# EAGLE schematic botball_v5 (EAGLE 6.5.0), part 3 of 3
## Sheet 42 of 44
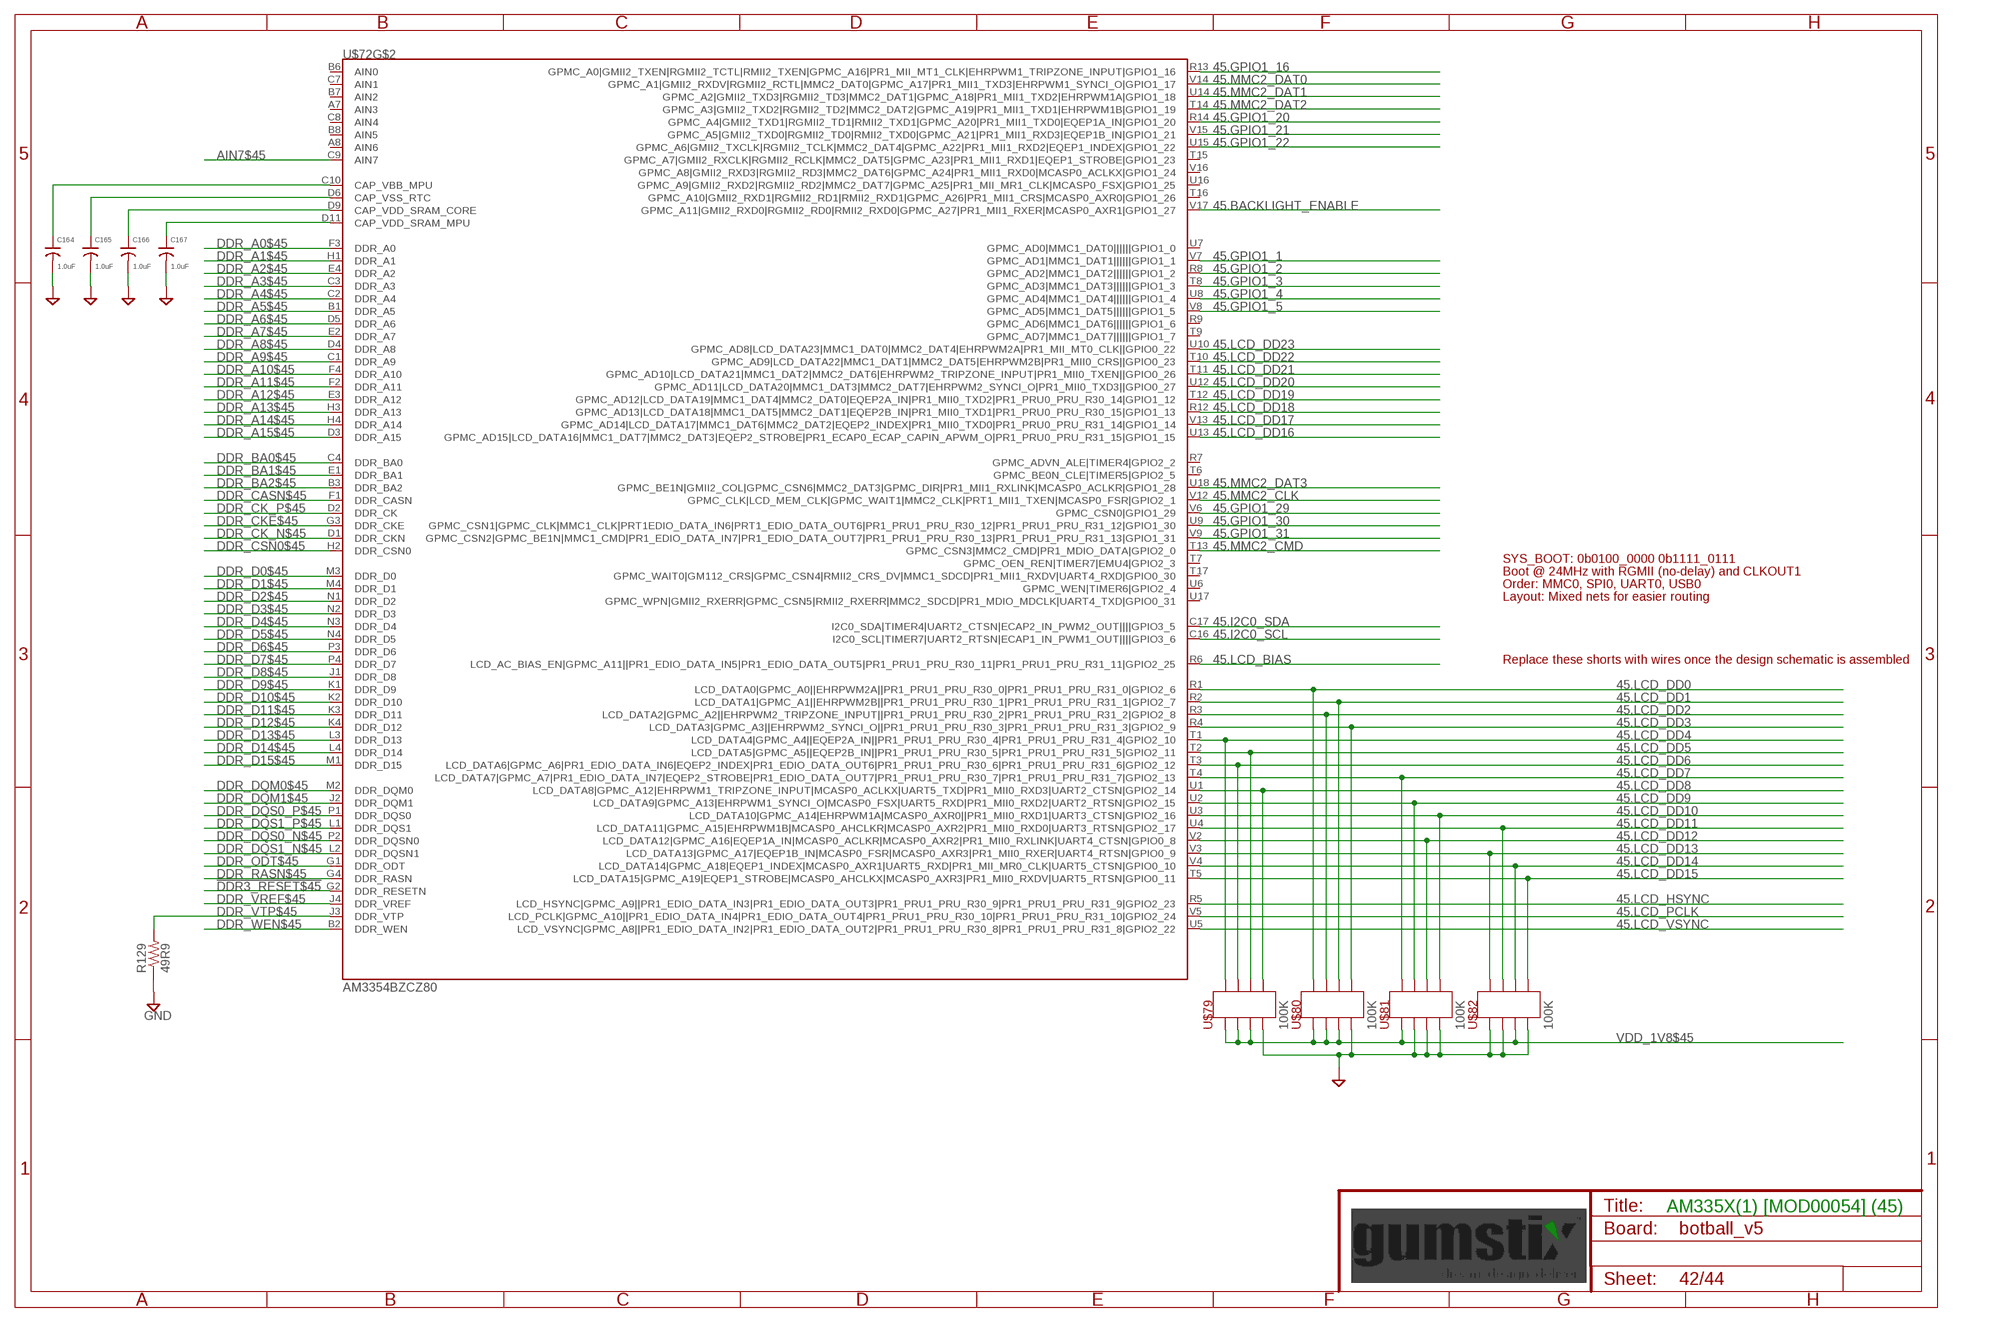
[diagram p41: schematic, sheet 42]

### Parts
C164  1.0uF  C0201  [0201]
C165  1.0uF  C0201  [0201]
C166  1.0uF  C0201  [0201]
C167  1.0uF  C0201  [0201]
R129  49R9  R0201  [0201]
U$72  AM3354BZCZ80  AM335_ZCZ  [BGA324C80P18X18]
U$79  100K  741C083  [741C083]
U$80  100K  741C083  [741C083]
U$81  100K  741C083  [741C083]
U$82  100K  741C083  [741C083]

### Nets
45.BACKLIGHT_ENABLE: U$72.V17(GPMC_A11|GMII2_RXD0|RGMII2_RD0|RMII2_RXD0|GPMC_A27|PR1_MII1_RXER|MCASP0_AXR1|GPIO1_27) ; also sheet 38
45.GPIO1_1: U$72.V7(GPMC_AD1|MMC1_DAT1||||||GPIO1_1) ; also sheet 37
45.GPIO1_2: U$72.R8(GPMC_AD2|MMC1_DAT2||||||GPIO1_2) ; also sheet 37
45.GPIO1_3: U$72.T8(GPMC_AD3|MMC1_DAT3||||||GPIO1_3) ; also sheet 11
45.GPIO1_4: U$72.U8(GPMC_AD4|MMC1_DAT4||||||GPIO1_4) ; also sheet 11
45.GPIO1_5: U$72.V8(GPMC_AD5|MMC1_DAT5||||||GPIO1_5) ; also sheet 39
45.GPIO1_16: U$72.R13(GPMC_A0|GMII2_TXEN|RGMII2_TCTL|RMII2_TXEN|GPMC_A16|PR1_MII_MT1_CLK|EHRPWM1_TRIPZONE_INPUT|GPIO1_16) ; also sheet 16
45.GPIO1_20: U$72.R14(GPMC_A4|GMII2_TXD1|RGMII2_TD1|RMII2_TXD1|GPMC_A20|PR1_MII1_TXD0|EQEP1A_IN|GPIO1_20) ; also sheet 24
45.GPIO1_21: U$72.V15(GPMC_A5|GMII2_TXD0|RGMII2_TD0|RMII2_TXD0|GPMC_A21|PR1_MII1_RXD3|EQEP1B_IN|GPIO1_21) ; also sheet 12
45.GPIO1_22: U$72.U15(GPMC_A6|GMII2_TXCLK|RGMII2_TCLK|MMC2_DAT4|GPMC_A22|PR1_MII1_RXD2|EQEP1_INDEX|GPIO1_22) ; also sheet 29
45.GPIO1_29: U$72.V6(GPMC_CSN0|GPIO1_29) ; also sheet 33
45.GPIO1_30: U$72.U9(GPMC_CSN1|GPMC_CLK|MMC1_CLK|PRT1EDIO_DATA_IN6|PRT1_EDIO_DATA_OUT6|PR1_PRU1_PRU_R30_12|PR1_PRU1_PRU_R31_12|GPIO1_30) ; also sheet 33
45.GPIO1_31: U$72.V9(GPMC_CSN2|GPMC_BE1N|MMC1_CMD|PR1_EDIO_DATA_IN7|PR1_EDIO_DATA_OUT7|PR1_PRU1_PRU_R30_13|PR1_PRU1_PRU_R31_13|GPIO1_31) ; also sheet 33
45.I2C0_SCL: U$72.C16(I2C0_SCL|TIMER7|UART2_RTSN|ECAP1_IN_PWM1_OUT||||GPIO3_6) ; also sheet 16,40,41
45.I2C0_SDA: U$72.C17(I2C0_SDA|TIMER4|UART2_CTSN|ECAP2_IN_PWM2_OUT||||GPIO3_5) ; also sheet 16,40,41
45.LCD_BIAS: U$72.R6(LCD_AC_BIAS_EN|GPMC_A11||PR1_EDIO_DATA_IN5|PR1_EDIO_DATA_OUT5|PR1_PRU1_PRU_R30_11|PR1_PRU1_PRU_R31_11|GPIO2_25) ; also sheet 38,39
45.LCD_DD0: U$72.R1(LCD_DATA0|GPMC_A0||EHRPWM2A||PR1_PRU1_PRU_R30_0|PR1_PRU1_PRU_R31_0|GPIO2_6) U$80.P5 ; also sheet 38,39
45.LCD_DD1: U$72.R2(LCD_DATA1|GPMC_A1||EHRPWM2B||PR1_PRU1_PRU_R30_1|PR1_PRU1_PRU_R31_1|GPIO2_7) U$80.P7 ; also sheet 38,39
45.LCD_DD2: U$72.R3(LCD_DATA2|GPMC_A2||EHRPWM2_TRIPZONE_INPUT||PR1_PRU1_PRU_R30_2|PR1_PRU1_PRU_R31_2|GPIO2_8) U$80.P6 ; also sheet 38,39
45.LCD_DD3: U$72.R4(LCD_DATA3|GPMC_A3||EHRPWM2_SYNCI_O||PR1_PRU1_PRU_R30_3|PR1_PRU1_PRU_R31_3|GPIO2_9) U$80.P8 ; also sheet 38,39
45.LCD_DD4: U$72.T1(LCD_DATA4|GPMC_A4||EQEP2A_IN||PR1_PRU1_PRU_R30_4|PR1_PRU1_PRU_R31_4|GPIO2_10) U$79.P5 ; also sheet 38,39
45.LCD_DD5: U$72.T2(LCD_DATA5|GPMC_A5||EQEP2B_IN||PR1_PRU1_PRU_R30_5|PR1_PRU1_PRU_R31_5|GPIO2_11) U$79.P7 ; also sheet 38,39
45.LCD_DD6: U$72.T3(LCD_DATA6|GPMC_A6|PR1_EDIO_DATA_IN6|EQEP2_INDEX|PR1_EDIO_DATA_OUT6|PR1_PRU1_PRU_R30_6|PR1_PRU1_PRU_R31_6|GPIO2_12) U$79.P6 ; also sheet 38,39
45.LCD_DD7: U$72.T4(LCD_DATA7|GPMC_A7|PR1_EDIO_DATA_IN7|EQEP2_STROBE|PR1_EDIO_DATA_OUT7|PR1_PRU1_PRU_R30_7|PR1_PRU1_PRU_R31_7|GPIO2_13) U$81.P5 ; also sheet 38,39
45.LCD_DD8: U$72.U1(LCD_DATA8|GPMC_A12|EHRPWM1_TRIPZONE_INPUT|MCASP0_ACLKX|UART5_TXD|PR1_MII0_RXD3|UART2_CTSN|GPIO2_14) U$79.P8 ; also sheet 38,39
45.LCD_DD9: U$72.U2(LCD_DATA9|GPMC_A13|EHRPWM1_SYNCI_O|MCASP0_FSX|UART5_RXD|PR1_MII0_RXD2|UART2_RTSN|GPIO2_15) U$81.P6 ; also sheet 38,39
45.LCD_DD10: U$72.U3(LCD_DATA10|GPMC_A14|EHRPWM1A|MCASP0_AXR0||PR1_MII0_RXD1|UART3_CTSN|GPIO2_16) U$81.P8 ; also sheet 38,39
45.LCD_DD11: U$72.U4(LCD_DATA11|GPMC_A15|EHRPWM1B|MCASP0_AHCLKR|MCASP0_AXR2|PR1_MII0_RXD0|UART3_RTSN|GPIO2_17) U$82.P6 ; also sheet 38,39
45.LCD_DD12: U$72.V2(LCD_DATA12|GPMC_A16|EQEP1A_IN|MCASP0_ACLKR|MCASP0_AXR2|PR1_MII0_RXLINK|UART4_CTSN|GPIO0_8) U$81.P7 ; also sheet 38,39
45.LCD_DD13: U$72.V3(LCD_DATA13|GPMC_A17|EQEP1B_IN|MCASP0_FSR|MCASP0_AXR3|PR1_MII0_RXER|UART4_RTSN|GPIO0_9) U$82.P5 ; also sheet 38,39
45.LCD_DD14: U$72.V4(LCD_DATA14|GPMC_A18|EQEP1_INDEX|MCASP0_AXR1|UART5_RXD|PR1_MII_MR0_CLK|UART5_CTSN|GPIO0_10) U$82.P7 ; also sheet 38,39
45.LCD_DD15: U$72.T5(LCD_DATA15|GPMC_A19|EQEP1_STROBE|MCASP0_AHCLKX|MCASP0_AXR3|PR1_MII0_RXDV|UART5_RTSN|GPIO0_11) U$82.P8 ; also sheet 38,39
45.LCD_DD16: U$72.U13(GPMC_AD15|LCD_DATA16|MMC1_DAT7|MMC2_DAT3|EQEP2_STROBE|PR1_ECAP0_ECAP_CAPIN_APWM_O|PR1_PRU0_PRU_R31_15|GPIO1_15) ; also sheet 38,39
45.LCD_DD17: U$72.V13(GPMC_AD14|LCD_DATA17|MMC1_DAT6|MMC2_DAT2|EQEP2_INDEX|PR1_MII0_TXD0|PR1_PRU0_PRU_R31_14|GPIO1_14) ; also sheet 38,39
45.LCD_DD18: U$72.R12(GPMC_AD13|LCD_DATA18|MMC1_DAT5|MMC2_DAT1|EQEP2B_IN|PR1_MII0_TXD1|PR1_PRU0_PRU_R30_15|GPIO1_13) ; also sheet 38,39
45.LCD_DD19: U$72.T12(GPMC_AD12|LCD_DATA19|MMC1_DAT4|MMC2_DAT0|EQEP2A_IN|PR1_MII0_TXD2|PR1_PRU0_PRU_R30_14|GPIO1_12) ; also sheet 38,39
45.LCD_DD20: U$72.U12(GPMC_AD11|LCD_DATA20|MMC1_DAT3|MMC2_DAT7|EHRPWM2_SYNCI_O|PR1_MII0_TXD3||GPIO0_27) ; also sheet 38,39
45.LCD_DD21: U$72.T11(GPMC_AD10|LCD_DATA21|MMC1_DAT2|MMC2_DAT6|EHRPWM2_TRIPZONE_INPUT|PR1_MII0_TXEN||GPIO0_26) ; also sheet 38,39
45.LCD_DD22: U$72.T10(GPMC_AD9|LCD_DATA22|MMC1_DAT1|MMC2_DAT5|EHRPWM2B|PR1_MII0_CRS||GPIO0_23) ; also sheet 38,39
45.LCD_DD23: U$72.U10(GPMC_AD8|LCD_DATA23|MMC1_DAT0|MMC2_DAT4|EHRPWM2A|PR1_MII_MT0_CLK||GPIO0_22) ; also sheet 38,39
45.LCD_HSYNC: U$72.R5(LCD_HSYNC|GPMC_A9||PR1_EDIO_DATA_IN3|PR1_EDIO_DATA_OUT3|PR1_PRU1_PRU_R30_9|PR1_PRU1_PRU_R31_9|GPIO2_23) ; also sheet 38,39
45.LCD_PCLK: U$72.V5(LCD_PCLK|GPMC_A10||PR1_EDIO_DATA_IN4|PR1_EDIO_DATA_OUT4|PR1_PRU1_PRU_R30_10|PR1_PRU1_PRU_R31_10|GPIO2_24) ; also sheet 38,39
45.LCD_VSYNC: U$72.U5(LCD_VSYNC|GPMC_A8||PR1_EDIO_DATA_IN2|PR1_EDIO_DATA_OUT2|PR1_PRU1_PRU_R30_8|PR1_PRU1_PRU_R31_8|GPIO2_22) ; also sheet 38,39
45.MMC2_CLK: U$72.V12(GPMC_CLK|LCD_MEM_CLK|GPMC_WAIT1|MMC2_CLK|PRT1_MII1_TXEN|MCASP0_FSR|GPIO2_1) ; also sheet 33
45.MMC2_CMD: U$72.T13(GPMC_CSN3|MMC2_CMD|PR1_MDIO_DATA|GPIO2_0) ; also sheet 33
45.MMC2_DAT0: U$72.V14(GPMC_A1|GMII2_RXDV|RGMII2_RCTL|MMC2_DAT0|GPMC_A17|PR1_MII1_TXD3|EHRPWM1_SYNCI_O|GPIO1_17) ; also sheet 33
45.MMC2_DAT1: U$72.U14(GPMC_A2|GMII2_TXD3|RGMII2_TD3|MMC2_DAT1|GPMC_A18|PR1_MII1_TXD2|EHRPWM1A|GPIO1_18) ; also sheet 33
45.MMC2_DAT2: U$72.T14(GPMC_A3|GMII2_TXD2|RGMII2_TD2|MMC2_DAT2|GPMC_A19|PR1_MII1_TXD1|EHRPWM1B|GPIO1_19) ; also sheet 33
45.MMC2_DAT3: U$72.U18(GPMC_BE1N|GMII2_COL|GPMC_CSN6|MMC2_DAT3|GPMC_DIR|PR1_MII1_RXLINK|MCASP0_ACLKR|GPIO1_28) ; also sheet 33
!DDR3_RESET$45: U$72.G2(DDR_RESETN) ; also sheet 41
AIN7$45 [analog]: U$72.C9(AIN7) ; also sheet 40
CAP_VBB_MPU$45: C164.1 U$72.C10(CAP_VBB_MPU)
CAP_VDD_SRAM_CORE$45: C166.1 U$72.D9(CAP_VDD_SRAM_CORE)
CAP_VDD_SRAM_MPU$45: C167.1 U$72.D11(CAP_VDD_SRAM_MPU)
CAP_VSS_RTC$45: C165.1 U$72.D6(CAP_VSS_RTC)
DDR_A0$45: U$72.F3(DDR_A0) ; also sheet 41
DDR_A1$45: U$72.H1(DDR_A1) ; also sheet 41
DDR_A2$45: U$72.E4(DDR_A2) ; also sheet 41
DDR_A3$45: U$72.C3(DDR_A3) ; also sheet 41
DDR_A4$45: U$72.C2(DDR_A4) ; also sheet 41
DDR_A5$45: U$72.B1(DDR_A5) ; also sheet 41
DDR_A6$45: U$72.D5(DDR_A6) ; also sheet 41
DDR_A7$45: U$72.E2(DDR_A7) ; also sheet 41
DDR_A8$45: U$72.D4(DDR_A8) ; also sheet 41
DDR_A9$45: U$72.C1(DDR_A9) ; also sheet 41
DDR_A10$45: U$72.F4(DDR_A10) ; also sheet 41
DDR_A11$45: U$72.F2(DDR_A11) ; also sheet 41
DDR_A12$45: U$72.E3(DDR_A12) ; also sheet 41
DDR_A13$45: U$72.H3(DDR_A13) ; also sheet 41
DDR_A14$45: U$72.H4(DDR_A14) ; also sheet 41
DDR_A15$45: U$72.D3(DDR_A15) ; also sheet 41
DDR_BA0$45: U$72.C4(DDR_BA0) ; also sheet 41
DDR_BA1$45: U$72.E1(DDR_BA1) ; also sheet 41
DDR_BA2$45: U$72.B3(DDR_BA2) ; also sheet 41
DDR_CASN$45: U$72.F1(DDR_CASN) ; also sheet 41
DDR_CK_N$45: U$72.D1(DDR_CKN) ; also sheet 41
DDR_CK_P$45: U$72.D2(DDR_CK) ; also sheet 41
DDR_CKE$45: U$72.G3(DDR_CKE) ; also sheet 41
DDR_CSN0$45: U$72.H2(DDR_CSN0) ; also sheet 41
DDR_D0$45: U$72.M3(DDR_D0) ; also sheet 41
DDR_D1$45: U$72.M4(DDR_D1) ; also sheet 41
DDR_D2$45: U$72.N1(DDR_D2) ; also sheet 41
DDR_D3$45: U$72.N2(DDR_D3) ; also sheet 41
DDR_D4$45: U$72.N3(DDR_D4) ; also sheet 41
DDR_D5$45: U$72.N4(DDR_D5) ; also sheet 41
DDR_D6$45: U$72.P3(DDR_D6) ; also sheet 41
DDR_D7$45: U$72.P4(DDR_D7) ; also sheet 41
DDR_D8$45: U$72.J1(DDR_D8) ; also sheet 41
DDR_D9$45: U$72.K1(DDR_D9) ; also sheet 41
DDR_D10$45: U$72.K2(DDR_D10) ; also sheet 41
DDR_D11$45: U$72.K3(DDR_D11) ; also sheet 41
DDR_D12$45: U$72.K4(DDR_D12) ; also sheet 41
DDR_D13$45: U$72.L3(DDR_D13) ; also sheet 41
DDR_D14$45: U$72.L4(DDR_D14) ; also sheet 41
DDR_D15$45: U$72.M1(DDR_D15) ; also sheet 41
DDR_DQM0$45: U$72.M2(DDR_DQM0) ; also sheet 41
DDR_DQM1$45: U$72.J2(DDR_DQM1) ; also sheet 41
DDR_DQS0_N$45: U$72.P2(DDR_DQSN0) ; also sheet 41
DDR_DQS0_P$45: U$72.P1(DDR_DQS0) ; also sheet 41
DDR_DQS1_N$45: U$72.L2(DDR_DQSN1) ; also sheet 41
DDR_DQS1_P$45: U$72.L1(DDR_DQS1) ; also sheet 41
DDR_ODT$45: U$72.G1(DDR_ODT) ; also sheet 41
DDR_RASN$45: U$72.G4(DDR_RASN) ; also sheet 41
DDR_VREF$45: U$72.J4(DDR_VREF) ; also sheet 41
DDR_VTP$45: R129.2 U$72.J3(DDR_VTP)
DDR_WEN$45: U$72.B2(DDR_WEN) ; also sheet 41
GND: C164.2 C165.2 C166.2 C167.2 R129.1 U$79.P4 U$80.P4 U$81.P2 U$81.P3 U$81.P4 U$82.P1 U$82.P2 U$82.P4 ; also sheet 2,3,4,5,6,7,9,10,11,12,13,14,15,16,17,18,19,20,21,22,23,24,25,26,27,28,29,30,31,32,33,34,35,36,37,38,39,40,41,43,44
VDD_1V8$45 [supply]: U$79.P1 U$79.P2 U$79.P3 U$80.P1 U$80.P2 U$80.P3 U$81.P1 U$82.P3 ; also sheet 40,41,43,44
Unconnected: U$72.A7(AIN3) U$72.A8(AIN6) U$72.B6(AIN0) U$72.B7(AIN2) U$72.B8(AIN5) U$72.C7(AIN1) U$72.C8(AIN4) U$72.R7(GPMC_ADVN_ALE|TIMER4|GPIO2_2) U$72.R9(GPMC_AD6|MMC1_DAT6||||||GPIO1_6) U$72.T6(GPMC_BE0N_CLE|TIMER5|GPIO2_5) U$72.T7(GPMC_OEN_REN|TIMER7|EMU4|GPIO2_3) U$72.T9(GPMC_AD7|MMC1_DAT7||||||GPIO1_7) U$72.T15(GPMC_A7|GMII2_RXCLK|RGMII2_RCLK|MMC2_DAT5|GPMC_A23|PR1_MII1_RXD1|EQEP1_STROBE|GPIO1_23) U$72.T16(GPMC_A10|GMII2_RXD1|RGMII2_RD1|RMII2_RXD1|GPMC_A26|PR1_MII1_CRS|MCASP0_AXR0|GPIO1_26) U$72.T17(GPMC_WAIT0|GM112_CRS|GPMC_CSN4|RMII2_CRS_DV|MMC1_SDCD|PR1_MII1_RXDV|UART4_RXD|GPIO0_30) U$72.U6(GPMC_WEN|TIMER6|GPIO2_4) U$72.U7(GPMC_AD0|MMC1_DAT0||||||GPIO1_0) U$72.U16(GPMC_A9|GMII2_RXD2|RGMII2_RD2|MMC2_DAT7|GPMC_A25|PR1_MII_MR1_CLK|MCASP0_FSX|GPIO1_25) U$72.U17(GPMC_WPN|GMII2_RXERR|GPMC_CSN5|RMII2_RXERR|MMC2_SDCD|PR1_MDIO_MDCLK|UART4_TXD|GPIO0_31) U$72.V16(GPMC_A8|GMII2_RXD3|RGMII2_RD3|MMC2_DAT6|GPMC_A24|PR1_MII1_RXD0|MCASP0_ACLKX|GPIO1_24)

### Notes on the sheet
- SYS_BOOT: 0b0100_0000 0b1111_0111
- Boot @ 24MHz with RGMII (no-delay) and CLKOUT1
- Order: MMC0, SPI0, UART0, USB0
- Layout: Mixed nets for easier routing
- Replace these shorts with wires once the design schematic is assembled
- AM335X(1) [MOD00054] (45)

## Sheet 43 of 44
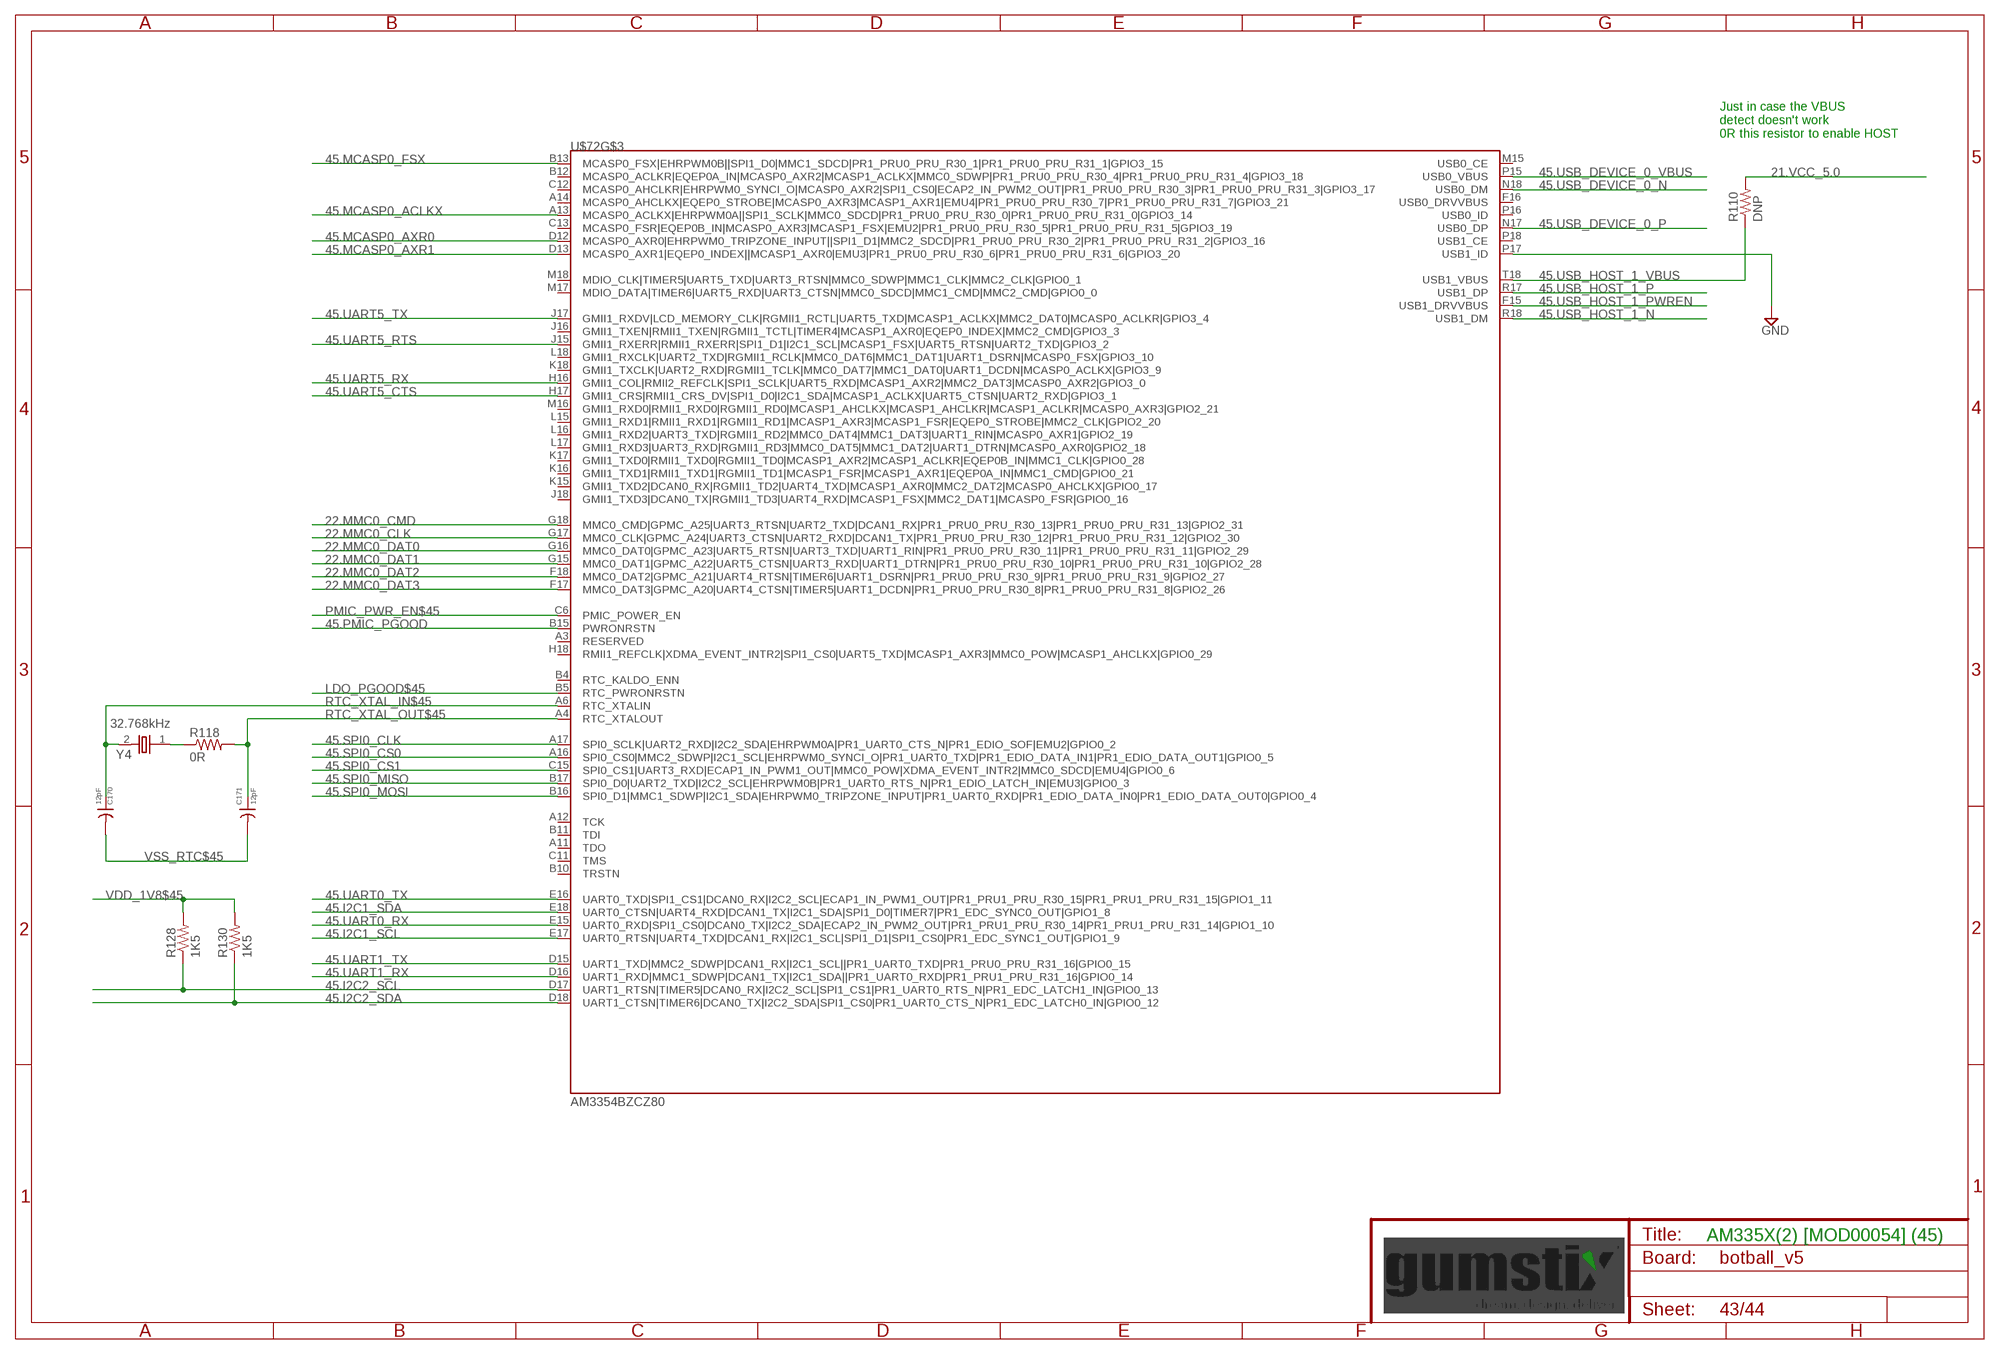
[diagram p42: schematic, sheet 43]

### Parts
C170  12pF  C0201  [0201]
C171  12pF  C0201  [0201]
R110  DNP  R0603  [0603]
R118  0R  R0201  [0201]
R128  1K5  R0201  [0201]
R130  1K5  R0201  [0201]
Y4  32.768kHz  X21206  [1206]

### Nets
21.VCC_5.0 [supply]: R110.2 ; also sheet 2,3,7,8,10,13,15,21,22,25,27,28,31,32,34,39,40
22.MMC0_CLK: U$72.G17(MMC0_CLK|GPMC_A24|UART3_CTSN|UART2_RXD|DCAN1_TX|PR1_PRU0_PRU_R30_12|PR1_PRU0_PRU_R31_12|GPIO2_30) ; also sheet 23
22.MMC0_CMD: U$72.G18(MMC0_CMD|GPMC_A25|UART3_RTSN|UART2_TXD|DCAN1_RX|PR1_PRU0_PRU_R30_13|PR1_PRU0_PRU_R31_13|GPIO2_31) ; also sheet 23
22.MMC0_DAT0: U$72.G16(MMC0_DAT0|GPMC_A23|UART5_RTSN|UART3_TXD|UART1_RIN|PR1_PRU0_PRU_R30_11|PR1_PRU0_PRU_R31_11|GPIO2_29) ; also sheet 23
22.MMC0_DAT1: U$72.G15(MMC0_DAT1|GPMC_A22|UART5_CTSN|UART3_RXD|UART1_DTRN|PR1_PRU0_PRU_R30_10|PR1_PRU0_PRU_R31_10|GPIO2_28) ; also sheet 23
22.MMC0_DAT2: U$72.F18(MMC0_DAT2|GPMC_A21|UART4_RTSN|TIMER6|UART1_DSRN|PR1_PRU0_PRU_R30_9|PR1_PRU0_PRU_R31_9|GPIO2_27) ; also sheet 23
22.MMC0_DAT3: U$72.F17(MMC0_DAT3|GPMC_A20|UART4_CTSN|TIMER5|UART1_DCDN|PR1_PRU0_PRU_R30_8|PR1_PRU0_PRU_R31_8|GPIO2_26) ; also sheet 23
45.I2C1_SCL: U$72.E17(UART0_RTSN|UART4_TXD|DCAN1_RX|I2C1_SCL|SPI1_D1|SPI1_CS0|PR1_EDC_SYNC1_OUT|GPIO1_9) ; also sheet 6,39
45.I2C1_SDA: U$72.E18(UART0_CTSN|UART4_RXD|DCAN1_TX|I2C1_SDA|SPI1_D0|TIMER7|PR1_EDC_SYNC0_OUT|GPIO1_8) ; also sheet 6,39
45.I2C2_SCL: R128.1 U$72.D17(UART1_RTSN|TIMER5|DCAN0_RX|I2C2_SCL|SPI1_CS1|PR1_UART0_RTS_N|PR1_EDC_LATCH1_IN|GPIO0_13) ; also sheet 2
45.I2C2_SDA: R130.1 U$72.D18(UART1_CTSN|TIMER6|DCAN0_TX|I2C2_SDA|SPI1_CS0|PR1_UART0_CTS_N|PR1_EDC_LATCH0_IN|GPIO0_12) ; also sheet 2
45.MCASP0_ACLKX: U$72.A13(MCASP0_ACLKX|EHRPWM0A||SPI1_SCLK|MMC0_SDCD|PR1_PRU0_PRU_R30_0|PR1_PRU0_PRU_R31_0|GPIO3_14) ; also sheet 16
45.MCASP0_AXR0: U$72.D12(MCASP0_AXR0|EHRPWM0_TRIPZONE_INPUT||SPI1_D1|MMC2_SDCD|PR1_PRU0_PRU_R30_2|PR1_PRU0_PRU_R31_2|GPIO3_16) ; also sheet 16
45.MCASP0_AXR1: U$72.D13(MCASP0_AXR1|EQEP0_INDEX||MCASP1_AXR0|EMU3|PR1_PRU0_PRU_R30_6|PR1_PRU0_PRU_R31_6|GPIO3_20) ; also sheet 16
45.MCASP0_FSX: U$72.B13(MCASP0_FSX|EHRPWM0B||SPI1_D0|MMC1_SDCD|PR1_PRU0_PRU_R30_1|PR1_PRU0_PRU_R31_1|GPIO3_15) ; also sheet 16
45.PMIC_PGOOD: U$72.B15(PWRONRSTN) ; also sheet 18,40
45.SPI0_CLK: U$72.A17(SPI0_SCLK|UART2_RXD|I2C2_SDA|EHRPWM0A|PR1_UART0_CTS_N|PR1_EDIO_SOF|EMU2|GPIO0_2) ; also sheet 9,38
45.SPI0_CS0: U$72.A16(SPI0_CS0|MMC2_SDWP|I2C1_SCL|EHRPWM0_SYNCI_O|PR1_UART0_TXD|PR1_EDIO_DATA_IN1|PR1_EDIO_DATA_OUT1|GPIO0_5) ; also sheet 38
45.SPI0_CS1: U$72.C15(SPI0_CS1|UART3_RXD|ECAP1_IN_PWM1_OUT|MMC0_POW|XDMA_EVENT_INTR2|MMC0_SDCD|EMU4|GPIO0_6) ; also sheet 9
45.SPI0_MISO: U$72.B17(SPI0_D0|UART2_TXD|I2C2_SCL|EHRPWM0B|PR1_UART0_RTS_N|PR1_EDIO_LATCH_IN|EMU3|GPIO0_3) ; also sheet 9,38
45.SPI0_MOSI: U$72.B16(SPI0_D1|MMC1_SDWP|I2C1_SDA|EHRPWM0_TRIPZONE_INPUT|PR1_UART0_RXD|PR1_EDIO_DATA_IN0|PR1_EDIO_DATA_OUT0|GPIO0_4) ; also sheet 9,38
45.UART0_RX: U$72.E15(UART0_RXD|SPI1_CS0|DCAN0_TX|I2C2_SDA|ECAP2_IN_PWM2_OUT|PR1_PRU1_PRU_R30_14|PR1_PRU1_PRU_R31_14|GPIO1_10) ; also sheet 32
45.UART0_TX: U$72.E16(UART0_TXD|SPI1_CS1|DCAN0_RX|I2C2_SCL|ECAP1_IN_PWM1_OUT|PR1_PRU1_PRU_R30_15|PR1_PRU1_PRU_R31_15|GPIO1_11) ; also sheet 32
45.UART1_RX: U$72.D16(UART1_RXD|MMC1_SDWP|DCAN1_TX|I2C1_SDA||PR1_UART0_RXD|PR1_PRU1_PRU_R31_16|GPIO0_14) ; also sheet 17
45.UART1_TX: U$72.D15(UART1_TXD|MMC2_SDWP|DCAN1_RX|I2C1_SCL||PR1_UART0_TXD|PR1_PRU0_PRU_R31_16|GPIO0_15) ; also sheet 17
45.UART5_CTS: U$72.H17(GMII1_CRS|RMII1_CRS_DV|SPI1_D0|I2C1_SDA|MCASP1_ACLKX|UART5_CTSN|UART2_RXD|GPIO3_1) ; also sheet 33
45.UART5_RTS: U$72.J15(GMII1_RXERR|RMII1_RXERR|SPI1_D1|I2C1_SCL|MCASP1_FSX|UART5_RTSN|UART2_TXD|GPIO3_2) ; also sheet 33
45.UART5_RX: U$72.H16(GMII1_COL|RMII2_REFCLK|SPI1_SCLK|UART5_RXD|MCASP1_AXR2|MMC2_DAT3|MCASP0_AXR2|GPIO3_0) ; also sheet 33
45.UART5_TX: U$72.J17(GMII1_RXDV|LCD_MEMORY_CLK|RGMII1_RCTL|UART5_TXD|MCASP1_ACLKX|MMC2_DAT0|MCASP0_ACLKR|GPIO3_4) ; also sheet 33
45.USB_DEVICE_0_N [USB]: U$72.N18(USB0_DM) ; also sheet 35
45.USB_DEVICE_0_P [USB]: U$72.N17(USB0_DP) ; also sheet 35
45.USB_DEVICE_0_VBUS: U$72.P15(USB0_VBUS) ; also sheet 35
45.USB_HOST_1_N [USB]: U$72.R18(USB1_DM) ; also sheet 21
45.USB_HOST_1_P [USB]: U$72.R17(USB1_DP) ; also sheet 21
45.USB_HOST_1_PWREN: U$72.F15(USB1_DRVVBUS) ; also sheet 21
45.USB_HOST_1_VBUS [supply]: R110.1 U$72.T18(USB1_VBUS) ; also sheet 21
GND: U$72.P17(USB1_ID) ; also sheet 2,3,4,5,6,7,9,10,11,12,13,14,15,16,17,18,19,20,21,22,23,24,25,26,27,28,29,30,31,32,33,34,35,36,37,38,39,40,41,42,44
LDO_PGOOD$45: U$72.B5(RTC_PWRONRSTN) ; also sheet 40
PMIC_PWR_EN$45: U$72.C6(PMIC_POWER_EN) ; also sheet 40
RTC_XTAL_IN$45: C170.1 U$72.A6(RTC_XTALIN) Y4.2
RTC_XTAL_OUT$45: C171.1 R118.2 U$72.A4(RTC_XTALOUT)
RTC_XTAL_PRE_OUT$45: R118.1 Y4.1
VDD_1V8$45 [supply]: R128.2 R130.2 ; also sheet 40,41,42,44
VSS_RTC$45: C170.2 C171.2 ; also sheet 44
Unconnected: U$72.A3(RESERVED) U$72.A11(TDO) U$72.A12(TCK) U$72.A14(MCASP0_AHCLKX|EQEP0_STROBE|MCASP0_AXR3|MCASP1_AXR1|EMU4|PR1_PRU0_PRU_R30_7|PR1_PRU0_PRU_R31_7|GPIO3_21) U$72.B4(RTC_KALDO_ENN) U$72.B10(TRSTN) U$72.B11(TDI) U$72.B12(MCASP0_ACLKR|EQEP0A_IN|MCASP0_AXR2|MCASP1_ACLKX|MMC0_SDWP|PR1_PRU0_PRU_R30_4|PR1_PRU0_PRU_R31_4|GPIO3_18) U$72.C11(TMS) U$72.C12(MCASP0_AHCLKR|EHRPWM0_SYNCI_O|MCASP0_AXR2|SPI1_CS0|ECAP2_IN_PWM2_OUT|PR1_PRU0_PRU_R30_3|PR1_PRU0_PRU_R31_3|GPIO3_17) U$72.C13(MCASP0_FSR|EQEP0B_IN|MCASP0_AXR3|MCASP1_FSX|EMU2|PR1_PRU0_PRU_R30_5|PR1_PRU0_PRU_R31_5|GPIO3_19) U$72.F16(USB0_DRVVBUS) U$72.H18(RMII1_REFCLK|XDMA_EVENT_INTR2|SPI1_CS0|UART5_TXD|MCASP1_AXR3|MMC0_POW|MCASP1_AHCLKX|GPIO0_29) U$72.J16(GMII1_TXEN|RMII1_TXEN|RGMII1_TCTL|TIMER4|MCASP1_AXR0|EQEP0_INDEX|MMC2_CMD|GPIO3_3) U$72.J18(GMII1_TXD3|DCAN0_TX|RGMII1_TD3|UART4_RXD|MCASP1_FSX|MMC2_DAT1|MCASP0_FSR|GPIO0_16) U$72.K15(GMII1_TXD2|DCAN0_RX|RGMII1_TD2|UART4_TXD|MCASP1_AXR0|MMC2_DAT2|MCASP0_AHCLKX|GPIO0_17) U$72.K16(GMII1_TXD1|RMII1_TXD1|RGMII1_TD1|MCASP1_FSR|MCASP1_AXR1|EQEP0A_IN|MMC1_CMD|GPIO0_21) U$72.K17(GMII1_TXD0|RMII1_TXD0|RGMII1_TD0|MCASP1_AXR2|MCASP1_ACLKR|EQEP0B_IN|MMC1_CLK|GPIO0_28) U$72.K18(GMII1_TXCLK|UART2_RXD|RGMII1_TCLK|MMC0_DAT7|MMC1_DAT0|UART1_DCDN|MCASP0_ACLKX|GPIO3_9) U$72.L15(GMII1_RXD1|RMII1_RXD1|RGMII1_RD1|MCASP1_AXR3|MCASP1_FSR|EQEP0_STROBE|MMC2_CLK|GPIO2_20) U$72.L16(GMII1_RXD2|UART3_TXD|RGMII1_RD2|MMC0_DAT4|MMC1_DAT3|UART1_RIN|MCASP0_AXR1|GPIO2_19) U$72.L17(GMII1_RXD3|UART3_RXD|RGMII1_RD3|MMC0_DAT5|MMC1_DAT2|UART1_DTRN|MCASP0_AXR0|GPIO2_18) U$72.L18(GMII1_RXCLK|UART2_TXD|RGMII1_RCLK|MMC0_DAT6|MMC1_DAT1|UART1_DSRN|MCASP0_FSX|GPIO3_10) U$72.M15(USB0_CE) U$72.M16(GMII1_RXD0|RMII1_RXD0|RGMII1_RD0|MCASP1_AHCLKX|MCASP1_AHCLKR|MCASP1_ACLKR|MCASP0_AXR3|GPIO2_21) U$72.M17(MDIO_DATA|TIMER6|UART5_RXD|UART3_CTSN|MMC0_SDCD|MMC1_CMD|MMC2_CMD|GPIO0_0) U$72.M18(MDIO_CLK|TIMER5|UART5_TXD|UART3_RTSN|MMC0_SDWP|MMC1_CLK|MMC2_CLK|GPIO0_1) U$72.P16(USB0_ID) U$72.P18(USB1_CE)

### Notes on the sheet
- Just in case the VBUS
  detect doesn't work
  0R this resistor to enable HOST
- AM335X(2) [MOD00054] (45)

## Sheet 44 of 44
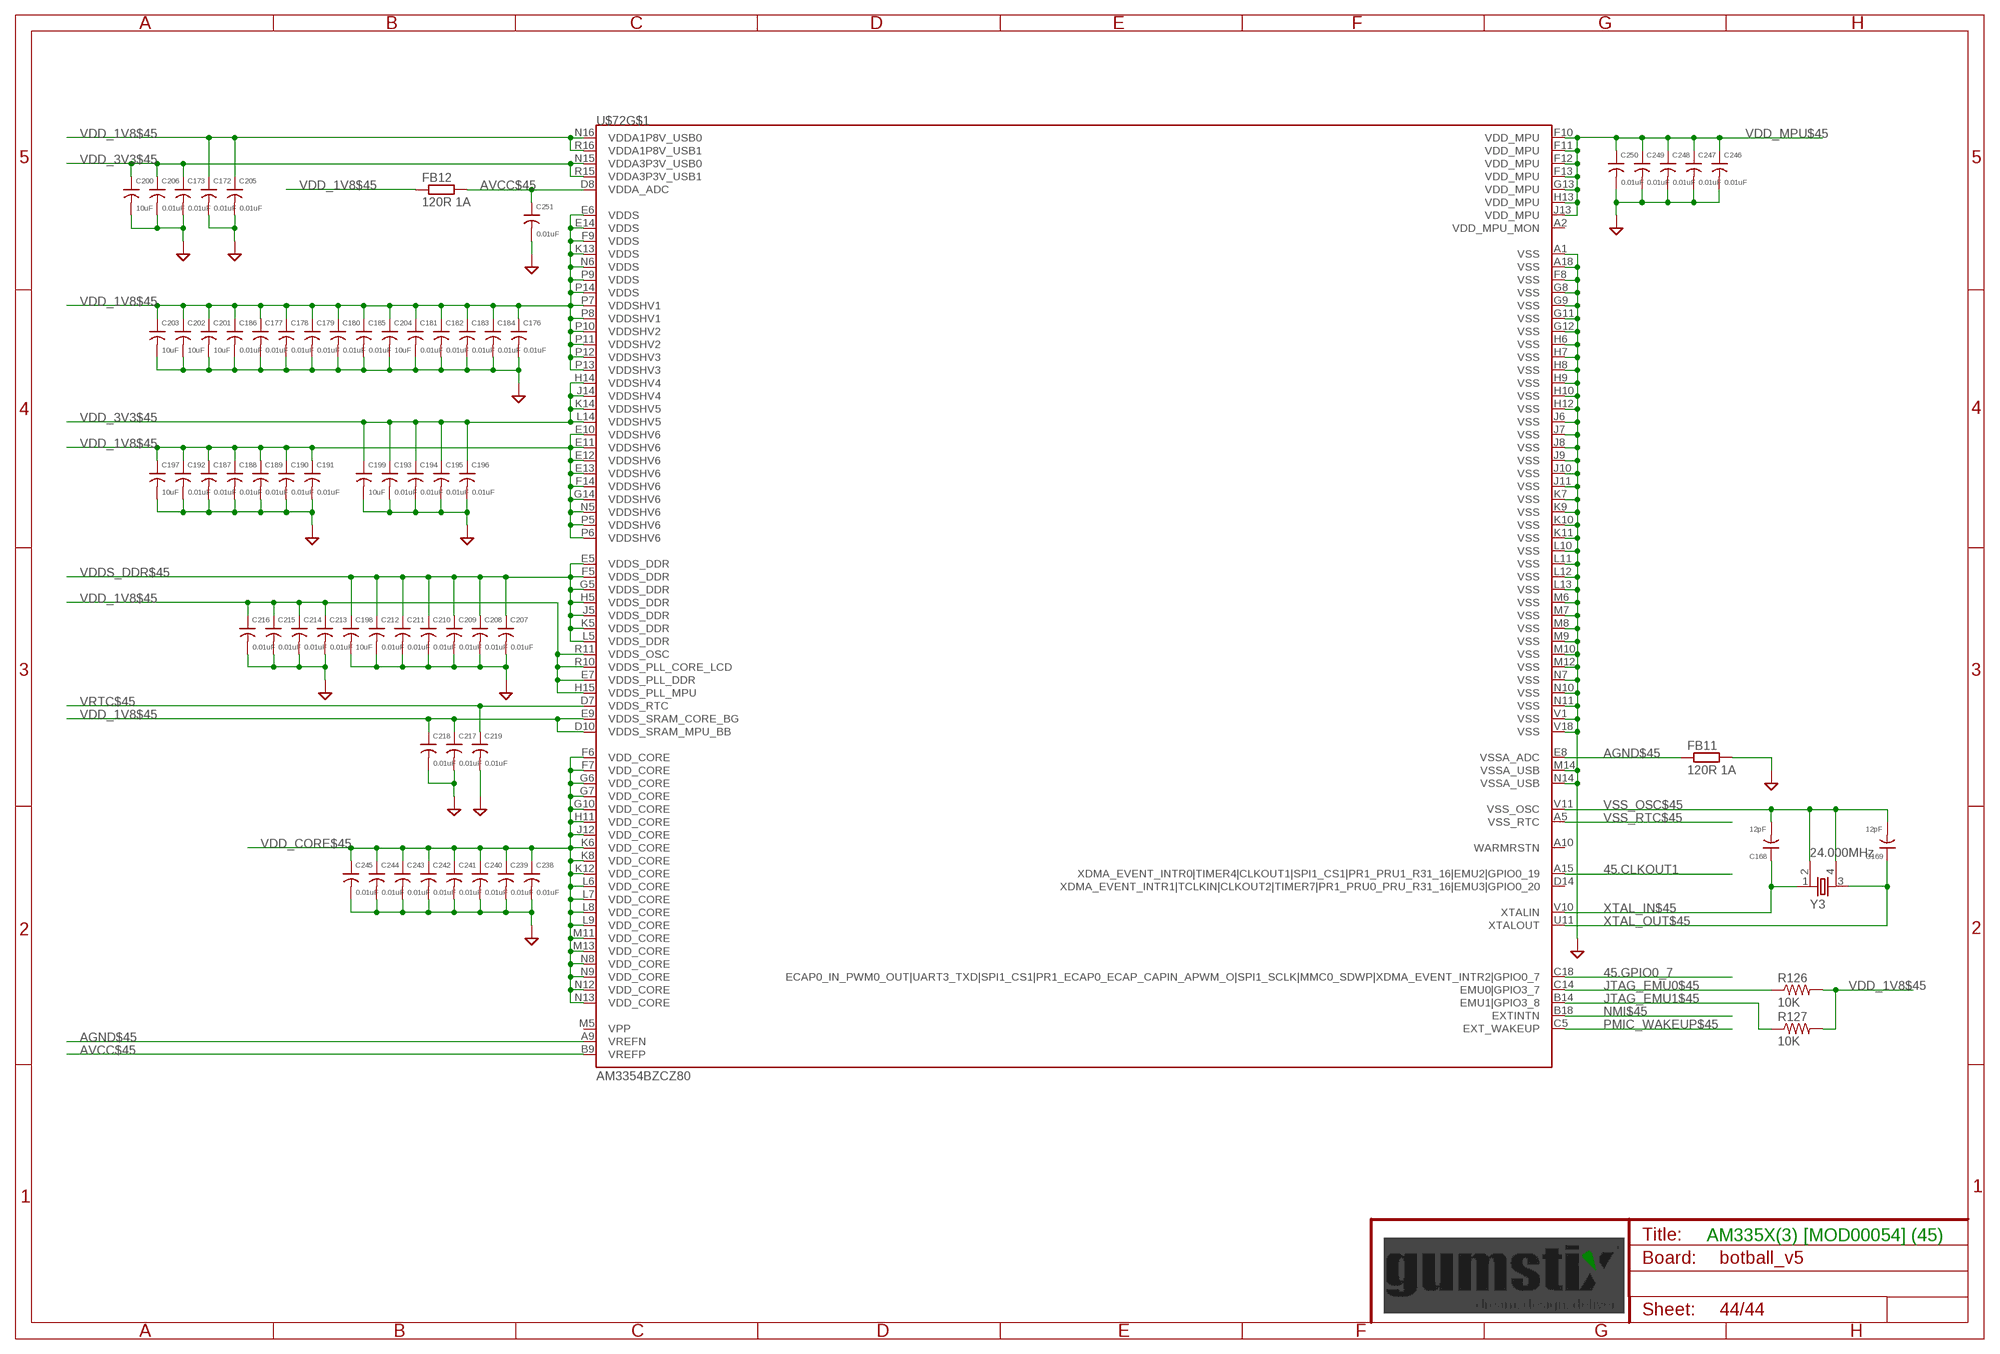
[diagram p43: schematic, sheet 44]

### Parts
C168  12pF  C0201  [0201]
C169  12pF  C0201  [0201]
C172  0.01uF  C0201  [0201]
C173  0.01uF  C0201  [0201]
C176  0.01uF  C0201  [0201]
C177  0.01uF  C0201  [0201]
C178  0.01uF  C0201  [0201]
C179  0.01uF  C0201  [0201]
C180  0.01uF  C0201  [0201]
C181  0.01uF  C0201  [0201]
C182  0.01uF  C0201  [0201]
C183  0.01uF  C0201  [0201]
C184  0.01uF  C0201  [0201]
C185  0.01uF  C0201  [0201]
C186  0.01uF  C0201  [0201]
C187  0.01uF  C0201  [0201]
C188  0.01uF  C0201  [0201]
C189  0.01uF  C0201  [0201]
C190  0.01uF  C0201  [0201]
C191  0.01uF  C0201  [0201]
C192  0.01uF  C0201  [0201]
C193  0.01uF  C0201  [0201]
C194  0.01uF  C0201  [0201]
C195  0.01uF  C0201  [0201]
C196  0.01uF  C0201  [0201]
C197  10uF  C0603  [0603]
C198  10uF  C0603  [0603]
C199  10uF  C0603  [0603]
C200  10uF  C0603  [0603]
C201  10uF  C0603  [0603]
C202  10uF  C0603  [0603]
C203  10uF  C0603  [0603]
C204  10uF  C0603  [0603]
C205  0.01uF  C0201  [0201]
C206  0.01uF  C0201  [0201]
C207  0.01uF  C0201  [0201]
C208  0.01uF  C0201  [0201]
C209  0.01uF  C0201  [0201]
C210  0.01uF  C0201  [0201]
C211  0.01uF  C0201  [0201]
C212  0.01uF  C0201  [0201]
C213  0.01uF  C0201  [0201]
C214  0.01uF  C0201  [0201]
C215  0.01uF  C0201  [0201]
C216  0.01uF  C0201  [0201]
C217  0.01uF  C0201  [0201]
C218  0.01uF  C0201  [0201]
C219  0.01uF  C0201  [0201]
C238  0.01uF  C0201  [0201]
C239  0.01uF  C0201  [0201]
C240  0.01uF  C0201  [0201]
C241  0.01uF  C0201  [0201]
C242  0.01uF  C0201  [0201]
C243  0.01uF  C0201  [0201]
C244  0.01uF  C0201  [0201]
C245  0.01uF  C0201  [0201]
C246  0.01uF  C0201  [0201]
C247  0.01uF  C0201  [0201]
C248  0.01uF  C0201  [0201]
C249  0.01uF  C0201  [0201]
C250  0.01uF  C0201  [0201]
C251  0.01uF  C0201  [0201]
FB11  120R 1A  FB0402  [0402]
FB12  120R 1A  FB0402  [0402]
R126  10K  R0201  [0201]
R127  10K  R0201  [0201]
Y3  24.000MHz  Y4CRYSTAL-3225  [CRYSTAL-3225]

### Nets
45.CLKOUT1: U$72.A15(XDMA_EVENT_INTR0|TIMER4|CLKOUT1|SPI1_CS1|PR1_PRU1_R31_16|EMU2|GPIO0_19) ; also sheet 33
45.GPIO0_7: U$72.C18(ECAP0_IN_PWM0_OUT|UART3_TXD|SPI1_CS1|PR1_ECAP0_ECAP_CAPIN_APWM_O|SPI1_SCLK|MMC0_SDWP|XDMA_EVENT_INTR2|GPIO0_7) ; also sheet 38
AGND$45: FB11.1 U$72.A9(VREFN) U$72.E8(VSSA_ADC)
AVCC$45 [analog]: C251.1 FB12.2 U$72.B9(VREFP) U$72.D8(VDDA_ADC)
GND: C172.2 C173.2 C176.2 C177.2 C178.2 C179.2 C180.2 C181.2 C182.2 C183.2 C184.2 C185.2 C186.2 C187.2 C188.2 C189.2 C190.2 C191.2 C192.2 C193.2 C194.2 C195.2 C196.2 C197.2 C198.2 C199.2 C200.2 C201.2 C202.2 C203.2 C204.2 C205.2 C206.2 C207.2 C208.2 C209.2 C210.2 C211.2 C212.2 C213.2 C214.2 C215.2 C216.2 C217.2 C218.2 C219.2 C238.2 C239.2 C240.2 C241.2 C242.2 C243.2 C244.2 C245.2 C246.2 C247.2 C248.2 C249.2 C250.2 C251.2 FB11.2 U$72.A1(VSS) U$72.A18(VSS) U$72.F8(VSS) U$72.G8(VSS) U$72.G9(VSS) U$72.G11(VSS) U$72.G12(VSS) U$72.H6(VSS) U$72.H7(VSS) U$72.H8(VSS) U$72.H9(VSS) U$72.H10(VSS) U$72.H12(VSS) U$72.J6(VSS) U$72.J7(VSS) U$72.J8(VSS) U$72.J9(VSS) U$72.J10(VSS) U$72.J11(VSS) U$72.K7(VSS) U$72.K9(VSS) U$72.K10(VSS) U$72.K11(VSS) U$72.L10(VSS) U$72.L11(VSS) U$72.L12(VSS) U$72.L13(VSS) U$72.M6(VSS) U$72.M7(VSS) U$72.M8(VSS) U$72.M9(VSS) U$72.M10(VSS) U$72.M12(VSS) U$72.M14(VSSA_USB) U$72.N7(VSS) U$72.N10(VSS) U$72.N11(VSS) U$72.N14(VSSA_USB) U$72.V1(VSS) U$72.V18(VSS) ; also sheet 2,3,4,5,6,7,9,10,11,12,13,14,15,16,17,18,19,20,21,22,23,24,25,26,27,28,29,30,31,32,33,34,35,36,37,38,39,40,41,42,43
JTAG_EMU0$45: R126.1 U$72.C14(EMU0|GPIO3_7)
JTAG_EMU1$45: R127.1 U$72.B14(EMU1|GPIO3_8)
NMI$45: U$72.B18(EXTINTN) ; also sheet 40
PMIC_WAKEUP$45: U$72.C5(EXT_WAKEUP) ; also sheet 40
VDD_1V8$45 [supply]: C172.1 C176.1 C177.1 C178.1 C179.1 C180.1 C181.1 C182.1 C183.1 C184.1 C185.1 C186.1 C187.1 C188.1 C189.1 C190.1 C191.1 C192.1 C197.1 C201.1 C202.1 C203.1 C204.1 C205.1 C213.1 C214.1 C215.1 C216.1 C217.1 C218.1 FB12.1 R126.2 R127.2 U$72.D10(VDDS_SRAM_MPU_BB) U$72.E6(VDDS) U$72.E7(VDDS_PLL_DDR) U$72.E9(VDDS_SRAM_CORE_BG) U$72.E10(VDDSHV6) U$72.E11(VDDSHV6) U$72.E12(VDDSHV6) U$72.E13(VDDSHV6) U$72.E14(VDDS) U$72.F9(VDDS) U$72.F14(VDDSHV6) U$72.G14(VDDSHV6) U$72.H15(VDDS_PLL_MPU) U$72.K13(VDDS) U$72.N5(VDDSHV6) U$72.N6(VDDS) U$72.N16(VDDA1P8V_USB0) U$72.P5(VDDSHV6) U$72.P6(VDDSHV6) U$72.P7(VDDSHV1) U$72.P8(VDDSHV1) U$72.P9(VDDS) U$72.P10(VDDSHV2) U$72.P11(VDDSHV2) U$72.P12(VDDSHV3) U$72.P13(VDDSHV3) U$72.P14(VDDS) U$72.R10(VDDS_PLL_CORE_LCD) U$72.R11(VDDS_OSC) U$72.R16(VDDA1P8V_USB1) ; also sheet 40,41,42,43
VDD_3V3$45 [supply]: C173.1 C193.1 C194.1 C195.1 C196.1 C199.1 C200.1 C206.1 U$72.H14(VDDSHV4) U$72.J14(VDDSHV4) U$72.K14(VDDSHV5) U$72.L14(VDDSHV5) U$72.N15(VDDA3P3V_USB0) U$72.R15(VDDA3P3V_USB1) ; also sheet 40
VDD_CORE$45 [supply]: C238.1 C239.1 C240.1 C241.1 C242.1 C243.1 C244.1 C245.1 U$72.F6(VDD_CORE) U$72.F7(VDD_CORE) U$72.G6(VDD_CORE) U$72.G7(VDD_CORE) U$72.G10(VDD_CORE) U$72.H11(VDD_CORE) U$72.J12(VDD_CORE) U$72.K6(VDD_CORE) U$72.K8(VDD_CORE) U$72.K12(VDD_CORE) U$72.L6(VDD_CORE) U$72.L7(VDD_CORE) U$72.L8(VDD_CORE) U$72.L9(VDD_CORE) U$72.M11(VDD_CORE) U$72.M13(VDD_CORE) U$72.N8(VDD_CORE) U$72.N9(VDD_CORE) U$72.N12(VDD_CORE) U$72.N13(VDD_CORE) ; also sheet 40
VDD_MPU$45 [supply]: C246.1 C247.1 C248.1 C249.1 C250.1 U$72.F10(VDD_MPU) U$72.F11(VDD_MPU) U$72.F12(VDD_MPU) U$72.F13(VDD_MPU) U$72.G13(VDD_MPU) U$72.H13(VDD_MPU) U$72.J13(VDD_MPU) ; also sheet 40
VDDS_DDR$45 [supply]: C198.1 C207.1 C208.1 C209.1 C210.1 C211.1 C212.1 U$72.E5(VDDS_DDR) U$72.F5(VDDS_DDR) U$72.G5(VDDS_DDR) U$72.H5(VDDS_DDR) U$72.J5(VDDS_DDR) U$72.K5(VDDS_DDR) U$72.L5(VDDS_DDR) ; also sheet 40,41
VRTC$45: C219.1 U$72.D7(VDDS_RTC) ; also sheet 40
VSS_OSC$45: C168.2 C169.2 U$72.V11(VSS_OSC) Y3.2 Y3.4
VSS_RTC$45: U$72.A5(VSS_RTC) ; also sheet 43
XTAL_IN$45: C168.1 U$72.V10(XTALIN) Y3.1
XTAL_OUT$45: C169.1 U$72.U11(XTALOUT) Y3.3
Unconnected: U$72.A2(VDD_MPU_MON) U$72.A10(WARMRSTN) U$72.D14(XDMA_EVENT_INTR1|TCLKIN|CLKOUT2|TIMER7|PR1_PRU0_PRU_R31_16|EMU3|GPIO0_20)

### Notes on the sheet
- AM335X(3) [MOD00054] (45)

## Power pins joined to a net without a drawn wire
VPP: U$72.M5(VPP)

## Library data of the parts
ACLK ACS0 ARX ATX BOOT0 BT4 BTEN GND TP1 VCC VCC1 WLDB WLEN WLRX WLTX = qualified_1:TP; HEIGHT: 0
C1 C8 C23 C98 C103 C114 C161 C162 = qualified_1:C; DM: 0; DR: 0.000; DX: 30.550; DY: 33.500; HEIGHT: 0.35; SHEETNO: 6
C2 C3 C6 C7 C18-C22 C55 C56 C96 C97 C101 C102 C112 C113 C139-C141 = qualified_1:C; DM: 0; DR: 0.000; DX: 30.550; DY: 33.500; HEIGHT: 0.25; SHEETNO: 6
C4 C5 C9 C14 C15 C33 C35 C37 C40 C42 C52-C54 C70 C72 C81 C88 C89 C91 C95 C99 C100 C104 C110 C111 C115 C142 C143 C174 C175 C236 C237 = qualified_1:C; HEIGHT: 0.35
C10 C16 C17 C34 C36 C38 C41 C51 C58 C93 C94 C106 C118 C119 C144-C152 C164-C173 C176-C196 C205-C219 C223 C238-C251 = qualified_1:C; HEIGHT: 0.25
C11 C90 C107 = qualified_1:C
C12 C29-C32 C59 C86 C108 C222 = qualified_1:C; HEIGHT: 0.51
C13 C39 C87 C92 C109 C116 C117 C120 C197-C204 C221 C224-C233 C235 = qualified_1:C; HEIGHT: 0.5
C24 C43 C44 C48 C50 C123 C125-C130 C132 C134 C138 = qualified_1:C; DM: 0; DR: 90.000; DX: 5.600; DY: 28.400; HEIGHT: 0.25; SHEETNO: 2
C25 C28 C45 C47 C65-C69 C71 C73-C80 C85 C131 C133 = qualified_1:C; DM: 0; DR: 90.000; DX: 5.600; DY: 28.400; HEIGHT: 0.35; SHEETNO: 2
C26 = qualified_1:C; DM: 0; DR: 90.000; DX: 56.200; DY: 38.400; HEIGHT: 0.5; SHEETNO: 2
C27 = qualified_1:C; DM: 0; DR: 90.000; DX: 47.400; DY: 38.400; HEIGHT: 0.35; SHEETNO: 2
C46 C82 C124 = qualified_1:C; DM: 0; DR: 0.000; DX: 66.900; DY: 11.100; HEIGHT: 0.5; SHEETNO: 4
C49 = qualified_1:C; DM: 0; DR: 180.000; DX: 70.250; DY: 11.150; HEIGHT: 0.35; SHEETNO: 5
C57 C137 = qualified_1:C; DM: 0; DR: 180.000; DX: 70.250; DY: 17.350; HEIGHT: 0.5; SHEETNO: 5
C60 C83 C121 = qualified_1:C; DM: 0; DR: -270.000; DX: -17.200; DY: 6.600; HEIGHT: 0.35; SHEETNO: 9
C61 = qualified_1:C; DM: 0; DR: -90.000; DX: 1.400; DY: -9.000; HEIGHT: 0.35; SHEETNO: 9
C62 = qualified_1:C; DM: 0; DR: 270.000; DX: 78.200; DY: 21.800; HEIGHT: 0.5; SHEETNO: 1
C63 = qualified_1:C; DM: 0; DR: 0.000; DX: 74.600; DY: 25.600; HEIGHT: 0.51; SHEETNO: 1
C64 = qualified_1:C; DM: 0; DR: 270.000; DX: 71.300; DY: 21.800; HEIGHT: 0.51; SHEETNO: 1
C84 C122 = qualified_1:C; DM: 0; DR: -90.000; DX: -20.800; DY: 6.600; HEIGHT: 0.35; SHEETNO: 9
C135 C136 = qualified_1:C; DM: 0; DR: 90.000; DX: 5.600; DY: 28.400; HEIGHT: 0.5; SHEETNO: 2
C153 = qualified_1:C; DM: 0; DR: 0.000; DX: 28.500; DY: 22.150; HEIGHT: 0.35; SHEETNO: 6
C154 C163 = qualified_1:C; DM: 0; DR: 180.000; DX: 18.750; DY: 22.200; HEIGHT: 0.35; SHEETNO: 6
C155 = qualified_1:C; DM: 0; DR: 180.000; DX: 30.100; DY: 7.400; HEIGHT: 0.35; SHEETNO: 6
C156 = qualified_1:C; DM: 0; DR: 180.000; DX: 16.400; DY: 25.850; HEIGHT: 0.35; SHEETNO: 6
C157 = qualified_1:C; DM: 0; DR: 90.000; DX: 31.900; DY: 17.000; HEIGHT: 0.35; SHEETNO: 6
C158 = qualified_1:C; DM: 0; DR: 0.000; DX: 33.150; DY: 23.850; HEIGHT: 0.5; SHEETNO: 6
C159 = qualified_1:C; DM: 0; DR: 90.000; DX: 29.300; DY: 24.900; HEIGHT: 0.5; SHEETNO: 6
C160 = qualified_1:C; DM: 0; DR: 180.000; DX: 19.150; DY: 25.700; HEIGHT: 0.5; SHEETNO: 6
C220 C252-C262 = qualified_1:C; DM: 0; DR: 0.000; DX: 66.300; DY: 12.650; HEIGHT: 0.25; SHEETNO: 4
C234 = qualified_1:C; HEIGHT: 2.8
CONN1 = qualified_1:U.FL; HEIGHT: 0.9
D1 D2 D11 D12 = qualified_1:LED; HEIGHT: 0.5
D3-D9 D13 D14 D16-D30 = qualified_1:ESD-DIODE; HEIGHT: 0.35
D10 = qualified_1:SCHOTTKY-DIODE: Schottky Diode
D31 = qualified_1:D
F1 F2 F4 F5 = qualified_1:PTC: Positive Temperature Coefficient Resistor; HEIGHT: 0.5
F3 = qualified_1:PTC: Positive Temperature Coefficient Resistor
FB1 FB3 FB4 = qualified_1:FB; DM: 0; DR: 90.000; DX: 49.400; DY: 38.400; HEIGHT: 0.35; SHEETNO: 2
FB2 = qualified_1:FB; DM: 0; DR: 90.000; DX: 54.000; DY: 38.400; HEIGHT: 0.35; SHEETNO: 2
FB5 FB6 FB11 FB12 = qualified_1:FB; HEIGHT: 0.35
FB7 = qualified_1:FB; DM: 0; DR: 0.000; DX: 18.850; DY: 23.600; HEIGHT: 0.35; SHEETNO: 6
FB8 = qualified_1:FB; DM: 0; DR: 180.000; DX: 31.850; DY: 25.300; HEIGHT: 0.35; SHEETNO: 6
FB9 = qualified_1:FB; DM: 0; DR: 90.000; DX: 11.200; DY: 28.400; HEIGHT: 0.35; SHEETNO: 2
FB10 = qualified_1:FB; DM: 0; DR: 0.000; DX: 56.400; DY: 28.200; HEIGHT: 0.51; SHEETNO: 2
IC1 = qualified_1:EP5368; HEIGHT: 1.1
IC2 = qualified_1:TPS62111; DM: 0; DR: 180.000; DX: 74.800; DY: 22.000; HEIGHT: 1; SHEETNO: 1
IC3 = qualified_1:STM32F10XVXT6: STM32F101/103 100 pin LQFP
IC4 = qualified_1:TFP100; DM: 0; DR: 180.000; DX: 24.200; DY: 14.800; HEIGHT: 1.1; SHEETNO: 6
J1 J6 J8 J11 = qualified_1:MA03X1
J2 J9 = qualified_1:MA03X2
J3 = qualified_1:COIN_CELL_6.8MM
J4 = qualified_1:1X06
J5 = qualified_1:2X06
J7 U5 U24 = qualified_1:2X03
J10 J14 = qualified_1:USB_MICRO_B
J12 = qualified_1:CONN20
J13 = qualified_1:CONN10
J15 = qualified_1:HDMI; DM: 0; DR: 180.000; DX: 26.000; DY: 29.400; SHEETNO: 6
JTAG = qualified_1:1365-10: DUAL ROW STRAIGHT HEADER 1364 SERIES. 1.27mm x 1.27mm. Without Fixing Post. SMT Source: http://www.leotronics.co.uk/Conexcon/Data%20Sheets/sec.%20A/1364ing.pdf; OC_FARNELL: unknown; OC_NEWARK: unknown
K1 = qualified_1:61400826021: WR-COM Horizontal Dual Stacked USB Type A
L1 L11-L13 = qualified_1:L; HEIGHT: 1.9
L2 = qualified_1:L; DM: 0; DR: 180.000; DX: 76.000; DY: 17.000; SHEETNO: 1
L3-L6 = qualified_1:COM_MODE_CHOKE; HEIGHT: 0.83
L7-L10 = qualified_1:COM_MODE_CHOKE; HEIGHT: 0.45
L14 = qualified_1:WE-PD2: SMD-Power Inductors WE-PD2 - Industry standard size - Current capability up to 14 A -- Switching regulators with low operating voltages (computer, laptop, mobile phones, pagers) -- Integrated DC/DC-converter -- Is recommended for the application with switching regulators from National Semiconductor, Linear Technology, Texas Instruments and Fairchild Semiconductor -- Perfectly suitable for switching regulators with extremely high efficiency
Q1 Q6 = qualified_1:BSP170P: SIPMOS(R) Small-Signal-Transistor P-Channel, Enhancement mode Source: http://www.infineon.com/upload/Document/BSP170P_Rev2.4.pdf
Q2-Q4 = qualified_1:BSS138: N-Channel Enhancement MOSFET; HEIGHT: 1.12
Q5 = qualified_1:ASF*: CRYSTAL CLOCK OSCILLATORS 5.0 Vdc or 3.3 Vdc - LOW PROFILE ULTRA MINIATURE CERAMIC SURFACE MOUNT Source: http://www.abracon.com/Oscillators/asf1-L-L1.pdf; MF: Abracon Corporation; MPN: ASFL1-125.000MHZ-EC-T; OC_FARNELL: 1838931; OC_NEWARK: 19M1882
R1 R2 R4-R17 R23-R25 R43 R55-R62 R64-R77 R82 R95 = qualified_1:R; HEIGHT: 0.35
R3 R18-R22 R26-R32 R34-R37 R41 R42 R78-R81 R93 R94 R118-R135 R138 R139 R340 R342 R344 = qualified_1:R; HEIGHT: 0.25
R33 R83 R84 R86-R92 = qualified_1:R; DM: 0; DR: -270.000; DX: -20.800; DY: 8.200; HEIGHT: 0.25; SHEETNO: 9
R38-R40 = qualified_1:R; DM: 0; DR: 270.000; DX: 72.800; DY: 18.400; HEIGHT: 0.35; SHEETNO: 1
R44-R51 R53 R54 R85 = qualified_1:R; DM: 0; DR: -270.000; DX: -20.800; DY: 8.200; HEIGHT: 0.35; SHEETNO: 9
R52 = qualified_1:R; HEIGHT: 0.51
R63 R110 R111 R136 R137 = qualified_1:R; HEIGHT: 0.5
R96 = qualified_1:R; DM: 0; DR: 180.000; DX: 33.800; DY: 14.800; HEIGHT: 0.35; SHEETNO: 6
R97 = qualified_1:R; DM: 0; DR: 270.000; DX: 33.800; DY: 19.600; HEIGHT: 0.35; SHEETNO: 6
R98 = qualified_1:R; DM: 0; DR: 270.000; DX: 35.500; DY: 19.600; HEIGHT: 0.35; SHEETNO: 6
R99 = qualified_1:R; DM: 0; DR: 0.000; DX: 34.800; DY: 7.400; HEIGHT: 0.35; SHEETNO: 6
R100 = qualified_1:R; DM: 0; DR: 0.000; DX: 32.600; DY: 7.400; HEIGHT: 0.35; SHEETNO: 6
R101 = qualified_1:R; DM: 0; DR: 270.000; DX: 32.000; DY: 19.600; HEIGHT: 0.35; SHEETNO: 6
R102 = qualified_1:R; DM: 0; DR: 90.000; DX: 26.950; DY: 23.400; HEIGHT: 0.35; SHEETNO: 6
R103 R113 R115-R117 = qualified_1:R; DM: 0; DR: 270.000; DX: 39.000; DY: 19.600; HEIGHT: 0.35; SHEETNO: 6
R104 = qualified_1:R; DM: 0; DR: 270.000; DX: 37.200; DY: 19.600; HEIGHT: 0.35; SHEETNO: 6
R105 R114 = qualified_1:R; DM: 0; DR: 0.000; DX: 16.400; DY: 24.650; HEIGHT: 0.35; SHEETNO: 6
R106-R109 R112 = qualified_1:R; DM: 0; DR: 0.000; DX: 41.800; DY: 21.200; HEIGHT: 0.35; SHEETNO: 6
RP1 RP2 RP4-RP10 = qualified_1:RP741X163; HEIGHT: 0.5
RP3 = qualified_1:RP741X083; HEIGHT: 0.4
S1 S2 = qualified_1:EVQ; HEIGHT: 2
SPKR+ SPKR- = qualified_1:TPSQ: Test pad; HEIGHT: 0
U1 U2 U10 U11 U21 U22 U27 U30 U32 = qualified_1:TXS0102
U3 = qualified_1:DS1339
U4 U23 = qualified_1:TB6612FNG: Toshiba 1A dual motor driver IC-09363
U6 U7 U25 U26 = qualified_1:APTB1615: Kingbright Bi-colour LED
U8 U20 U29 = qualified_1:TXS0108E
U9 = qualified_1:JS102011SAQN
U12 = qualified_1:L3G4200D
U13 = qualified_1:LSM303D
U14 = qualified_1:TPS2052; HEIGHT: 1.1
U15 = qualified_1:TLV320AIC3106
U16 = qualified_1:74AVC2T245; HEIGHT: 0.6
U17 = qualified_1:LM4862; HEIGHT: 1.75
U18 = qualified_1:USB2513; HEIGHT: 1
U19 = qualified_1:OR_GATE_3: Single 3-Input Positive-OR Gate SN74LVC1G332 http://www.ti.com/lit/ds/symlink/sn74lvc1g332.pdf
U28 = qualified_1:WL1801MOD
U31 = qualified_1:EVQ
U33 = qualified_1:PCA9306; HEIGHT: 1.3
U34 = qualified_1:AT24C*: 2-wire serial EEPROM; HEIGHT: 1
U35 = qualified_1:TPS65217: PMIC for TI Am335x processors
U$27 = qualified_1:TPS5450
U$30 = qualified_1:USD_3M2900; HEIGHT: 2
U$66 = qualified_1:ADS7846; HEIGHT: 1
U$67-U$69 = qualified_1:74AC164245; HEIGHT: 1.14
U$70 = qualified_1:FH12-40-NHD-4.3
U$72 = qualified_1:AM335_ZCZ
U$79-U$82 = qualified_1:741C083: Resisor Network 100K Version: 774-741C083104JP
U$101 = qualified_1:MT41K256M16
X1 = qualified_1:X2; HEIGHT: 1
X2 = qualified_1:ASF*: CRYSTAL CLOCK OSCILLATORS 5.0 Vdc or 3.3 Vdc - LOW PROFILE ULTRA MINIATURE CERAMIC SURFACE MOUNT Source: http://www.abracon.com/Oscillators/asf1-L-L1.pdf; OC_FARNELL: unknown; OC_NEWARK: unknown
Y1-Y3 = qualified_1:Y4; HEIGHT: 0.8
Y4 = qualified_1:X2; HEIGHT: 0.51

## Net classes
1 supply: width 0.254 mm
4 xxwide: width 0.203 mm
5 USB: width 0.2 mm, clearance 0.2 mm
6 HDMI: width 0.2 mm, clearance 0.3 mm